# Altium schematic sheet DigitalCompass.SchDoc: Digital Compass
size A4; SheetNumber: 1; SheetTotal: 1
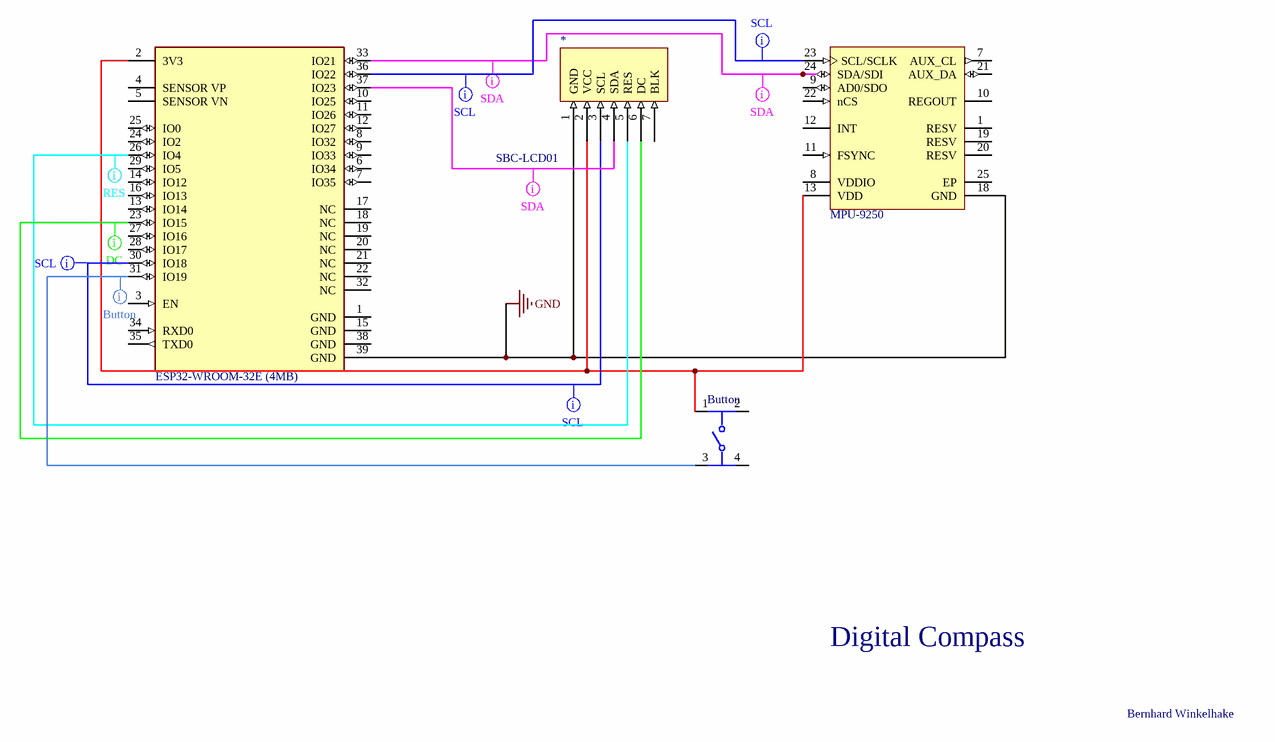
[diagram p0: DigitalCompass.SchDoc]

## Parts
*  SBC-LCD01
Button  PTS645SM43SMTR92LFS  [FP-PTS645SM43SMTR92LFS-MFG]  (value not drawn)
MD?  ESP32-WROOM-32E (4MB)  [FP-ESP32-WROOM-32E_4MB-MFG]
U?  MPU-9250  [INSE-QFN-24-1700X1540TP_M]  (part A of 2)

## Nets
GND: *.1(GND) MD?.39(GND) U?.18(GND)
Net*_2: *.2(VCC) Button.1 MD?.2(3V3) U?.13(VDD)
Net*_3: *.3(SCL) MD?.30(IO18)
Net*_4: *.4(SDA) MD?.37(IO23)
Net*_5: *.5(RES) MD?.26(IO4)
Net*_6: *.6(DC) MD?.23(IO15)
NetButton_3: Button.3 MD?.31(IO19)
NetMD?_33: MD?.33(IO21) U?.24(SDA/SDI)
NetMD?_36: MD?.36(IO22) U?.23(SCL/SCLK)

Not connected (* = marked no-connect by the designer): * 7(BLK); Button 2 4; MD? 1(GND) 3(EN) 4(SENSOR_VP) 5(SENSOR_VN) 6(IO34) 7(IO35) 8(IO32) 9(IO33) 10(IO25) 11(IO26) 12(IO27) 13(IO14) 14(IO12) 15(GND) 16(IO13) 17(NC) 18(NC) 19(NC) 20(NC) 21(NC) 22(NC) 24(IO2) 25(IO0) 27(IO16) 28(IO17) 29(IO5) 32(NC) 34(RXD0) 35(TXD0) 38(GND); U? 1(RESV) 7(AUX_CL) 8(VDDIO) 9(AD0/SDO) 10(REGOUT) 11(FSYNC) 12(INT) 19(RESV) 20(RESV) 21(AUX_DA) 22(nCS) 25(EP)

## Layout directives
mark named SDA: Net*_4, NetMD?_33
mark named SCL: Net*_3, NetMD?_36
mark named RES: Net*_5
mark named DC: Net*_6
mark named Button: NetButton_3

## Notes on the sheet
- Digital Compass
- Bernhard Winkelhake

## Library data of the parts
* = CMP-010-00027-1: Clone of Connection for an LCD Display
Button = CMP-2000-05160-2: SWITCH TACTILE SPST-NO 0.05A 12V; Contact Resistance: 100mR; Throw Configuration: SPST; Illumination Type: Non-Illuminated; Mechanical Life: 100000Cycles; Current Rating: 50mA; Switch Function: Off-Mom; Actuator Length: 0.85mm; Actuator Material: Nylon; Actuator Type: Standard; Operating Force: 160gf; Min Operating Temperature: -20°C; REACH SVHC: No SVHC; Termination: Gull Wing; Case/Package: SMD/SMT; Packaging: Tape and Reel; Mount: Surface Mount; Voltage Rating (DC): 12V; Orientation: Straight; Lead Free: Lead Free; Contact Material: Silver; Color: Black; Max Current Rating: 50mA; Contact Plating: Silver; Depth: 9mm; Package Quantity: 1; Max Voltage Rating (DC): 12V; Length: 6mm; Max Operating Temperature: 60°C
MD? = CMP-194065-000026-1: RX TXRX MOD WIFI TRACE ANT SMD
U? = CMP-010-00006-3: 9-axis MotionTracking device, 2.4 to 3,6 V, -40 to 85 degC, 24-Pin QFN, RoHS, Tape and Reel; Manufacturer: InvenSense; Sensor Type: Motion; Max Supply Voltage: 3.6V; Min Supply Voltage: 2.4V; Package Description: 24-Pin Quad Flat No-lead Package, Body 3 x 3 mm, Pitch 0.4 mm; RoHS Compliant: True; Datasheet Version: Rev. 1.0, 01/2014; Pins: 24; Mounting Technology: SM; Datasheet URL: http://datasheet.octopart.com/MPU-9250-InvenSense-datasheet-21859386.pdf; Package Quantity: 5000; Package Reference: QFN-24; Case/Package: Module